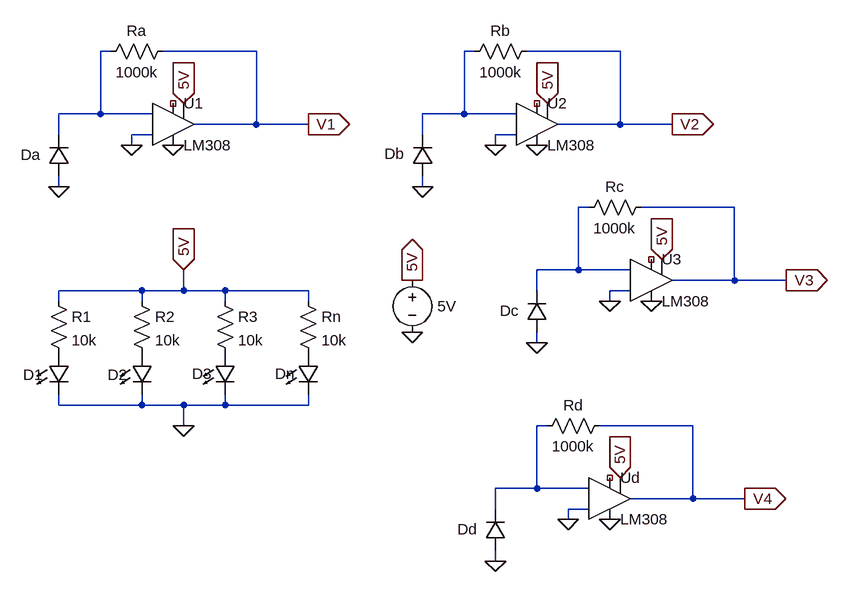
[diagram p0: schematic n_element_sensor_system.asc]
n_element_sensor_system.asc, the LTspice schematic file:
Version 4
SHEET 1 1096 680
WIRE -32 -208 -48 -208
WIRE 192 -208 48 -208
WIRE 528 -208 512 -208
WIRE 752 -208 608 -208
WIRE -48 -112 -48 -208
WIRE -48 -112 -112 -112
WIRE 32 -112 -48 -112
WIRE 512 -112 512 -208
WIRE 512 -112 448 -112
WIRE 592 -112 512 -112
WIRE 192 -96 192 -208
WIRE 192 -96 96 -96
WIRE 272 -96 192 -96
WIRE 752 -96 752 -208
WIRE 752 -96 656 -96
WIRE 832 -96 752 -96
WIRE -112 -80 -112 -112
WIRE 32 -80 0 -80
WIRE 448 -80 448 -112
WIRE 592 -80 560 -80
WIRE 0 -64 0 -80
WIRE 560 -64 560 -80
WIRE -112 0 -112 -16
WIRE 448 0 448 -16
WIRE 704 32 688 32
WIRE 928 32 784 32
WIRE 688 128 688 32
WIRE 688 128 624 128
WIRE 768 128 688 128
WIRE 928 144 928 32
WIRE 928 144 832 144
WIRE 1008 144 928 144
WIRE 16 160 -112 160
WIRE 80 160 80 128
WIRE 80 160 16 160
WIRE 144 160 80 160
WIRE 272 160 144 160
WIRE 624 160 624 128
WIRE 768 160 736 160
WIRE -112 176 -112 160
WIRE 16 176 16 160
WIRE 144 176 144 160
WIRE 272 176 272 160
WIRE 736 176 736 160
WIRE 624 240 624 224
WIRE -112 336 -112 320
WIRE 16 336 16 320
WIRE 16 336 -112 336
WIRE 80 336 16 336
WIRE 144 336 144 320
WIRE 144 336 80 336
WIRE 272 336 272 320
WIRE 272 336 144 336
WIRE 80 368 80 336
WIRE 640 368 624 368
WIRE 864 368 720 368
WIRE 624 464 624 368
WIRE 624 464 560 464
WIRE 704 464 624 464
WIRE 864 480 864 368
WIRE 864 480 768 480
WIRE 944 480 864 480
WIRE 560 496 560 464
WIRE 704 496 672 496
WIRE 672 512 672 496
WIRE 560 576 560 560
FLAG 432 224 0
FLAG 432 144 5V
IOPIN 432 144 Out
FLAG 80 368 0
FLAG 80 128 5V
IOPIN 80 128 In
FLAG 560 -64 0
FLAG 624 -64 0
FLAG 640 -128 5V
IOPIN 640 -128 In
FLAG 832 -96 V2
IOPIN 832 -96 Out
FLAG 448 0 0
FLAG 736 176 0
FLAG 800 176 0
FLAG 816 112 5V
IOPIN 816 112 In
FLAG 1008 144 V3
IOPIN 1008 144 Out
FLAG 624 240 0
FLAG 0 -64 0
FLAG 64 -64 0
FLAG 80 -128 5V
IOPIN 80 -128 In
FLAG 272 -96 V1
IOPIN 272 -96 Out
FLAG -112 0 0
FLAG 672 512 0
FLAG 736 512 0
FLAG 752 448 5V
IOPIN 752 448 In
FLAG 944 480 V4
IOPIN 944 480 Out
FLAG 560 576 0
SYMBOL voltage 432 128 R0
WINDOW 0 24 16 Invisible 2
WINDOW 3 39 56 Left 2
SYMATTR InstName 5V
SYMATTR Value 5V
SYMBOL res -128 160 R0
SYMATTR InstName R1
SYMATTR Value 10k
SYMBOL res 0 160 R0
SYMATTR InstName R2
SYMATTR Value 10k
SYMBOL res 128 160 R0
SYMATTR InstName R3
SYMATTR Value 10k
SYMBOL res 256 160 R0
SYMATTR InstName Rn
SYMATTR Value 10k
SYMBOL LED -128 256 R0
WINDOW 0 -39 33 Left 2
WINDOW 3 24 64 Invisible 2
SYMATTR InstName D1
SYMBOL LED 0 256 R0
WINDOW 0 -37 33 Left 2
WINDOW 3 24 64 Invisible 2
SYMATTR InstName D2
SYMBOL LED 128 256 R0
WINDOW 0 -35 32 Left 2
WINDOW 3 24 64 Invisible 2
SYMATTR InstName D3
SYMBOL LED 256 256 R0
WINDOW 0 -35 32 Left 2
WINDOW 3 24 64 Invisible 2
SYMATTR InstName Dn
SYMBOL OpAmps\\LM308 624 -160 R0
SYMATTR InstName U2
SYMBOL res 624 -224 R90
WINDOW 0 0 56 VBottom 2
WINDOW 3 32 56 VTop 2
SYMATTR InstName Rb
SYMATTR Value 1000k
SYMBOL diode 464 -16 R180
WINDOW 0 44 35 Left 2
WINDOW 3 24 0 Invisible 2
SYMATTR InstName Db
SYMBOL OpAmps\\LM308 800 80 R0
SYMATTR InstName U3
SYMBOL res 800 16 R90
WINDOW 0 0 56 VBottom 2
WINDOW 3 32 56 VTop 2
SYMATTR InstName Rc
SYMATTR Value 1000k
SYMBOL diode 640 224 R180
WINDOW 0 44 33 Left 2
WINDOW 3 24 0 Invisible 2
SYMATTR InstName Dc
SYMBOL OpAmps\\LM308 64 -160 R0
SYMATTR InstName U1
SYMBOL res 64 -224 R90
WINDOW 0 0 56 VBottom 2
WINDOW 3 32 56 VTop 2
SYMATTR InstName Ra
SYMATTR Value 1000k
SYMBOL diode -96 -16 R180
WINDOW 0 44 33 Left 2
WINDOW 3 24 0 Invisible 2
SYMATTR InstName Da
SYMBOL OpAmps\\LM308 736 416 R0
SYMATTR InstName Ud
SYMBOL res 736 352 R90
WINDOW 0 0 56 VBottom 2
WINDOW 3 32 56 VTop 2
SYMATTR InstName Rd
SYMATTR Value 1000k
SYMBOL diode 576 560 R180
WINDOW 0 44 33 Left 2
WINDOW 3 24 0 Invisible 2
SYMATTR InstName Dd

The netlist it stands for:
* n_element_sensor_system.asc
V§5V 5V 0 5V
R1 5V P001 10k
R2 5V P002 10k
R3 5V P003 10k
Rn 5V P004 10k
D1 P001 0 D
D2 P002 0 D
D3 P003 0 D
Dn P004 0 D
XU2 0 N002 5V 0 V2 NC_01 NC_02 LT1008
Rb V2 N002 1000k
Db 0 N002 D
XU3 0 N003 5V 0 V3 NC_03 NC_04 LT1008
Rc V3 N003 1000k
Dc 0 N003 D
XU1 0 N001 5V 0 V1 NC_05 NC_06 LT1008
Ra V1 N001 1000k
Da 0 N001 D
XUd 0 N004 5V 0 V4 NC_07 NC_08 LT1008
Rd V4 N004 1000k
Dd 0 N004 D
.model D D
.lib standard.dio
.lib LTC.lib
.backanno
.end